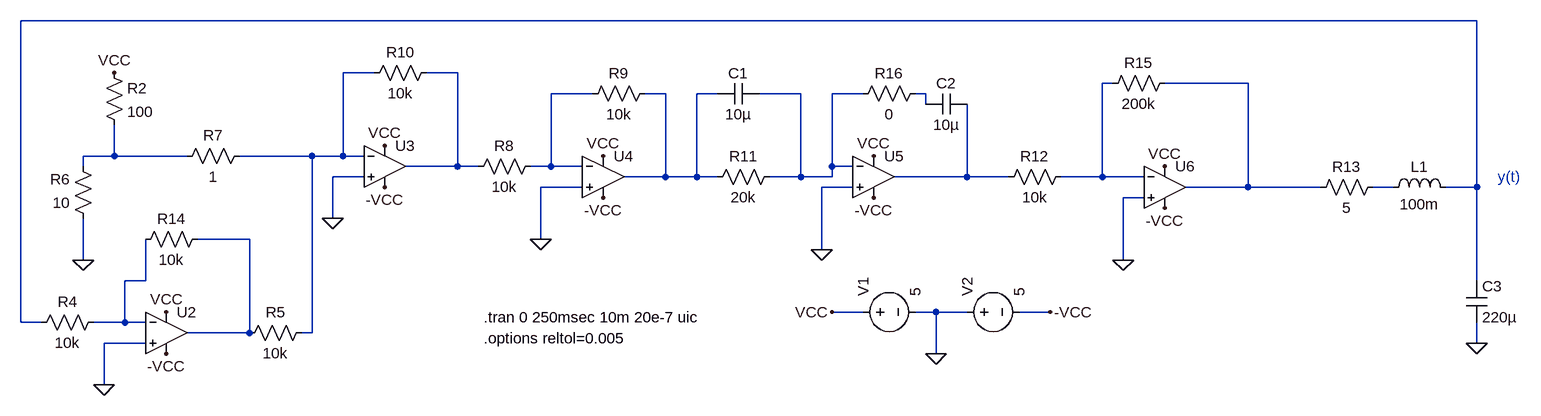
[diagram p0: schematic Circuito con componentes pasivos.asc]
Circuito con componentes pasivos.asc, the LTspice schematic file:
Version 4
SHEET 1 1872 984
WIRE 1536 -672 -704 -672
WIRE -160 -592 -208 -592
WIRE -32 -592 -80 -592
WIRE 976 -576 960 -576
WIRE 1184 -576 1056 -576
WIRE 176 -560 112 -560
WIRE 288 -560 256 -560
WIRE 368 -560 336 -560
WIRE 496 -560 432 -560
WIRE 592 -560 544 -560
WIRE 688 -560 672 -560
WIRE 688 -544 688 -560
WIRE -560 -464 -560 -512
WIRE -560 -464 -608 -464
WIRE -448 -464 -560 -464
WIRE -256 -464 -368 -464
WIRE -208 -464 -208 -592
WIRE -208 -464 -256 -464
WIRE -176 -464 -208 -464
WIRE -608 -448 -608 -464
WIRE -32 -448 -32 -592
WIRE -32 -448 -112 -448
WIRE 0 -448 -32 -448
WIRE 112 -448 112 -560
WIRE 112 -448 80 -448
WIRE 160 -448 112 -448
WIRE 544 -448 544 -560
WIRE 576 -448 544 -448
WIRE -176 -432 -224 -432
WIRE 288 -432 288 -560
WIRE 288 -432 224 -432
WIRE 336 -432 336 -560
WIRE 336 -432 288 -432
WIRE 368 -432 336 -432
WIRE 496 -432 496 -560
WIRE 496 -432 448 -432
WIRE 544 -432 544 -448
WIRE 544 -432 496 -432
WIRE 752 -432 752 -544
WIRE 752 -432 640 -432
WIRE 816 -432 752 -432
WIRE 960 -432 960 -576
WIRE 960 -432 896 -432
WIRE 1024 -432 960 -432
WIRE 160 -416 96 -416
WIRE 576 -416 528 -416
WIRE 1184 -416 1184 -576
WIRE 1184 -416 1088 -416
WIRE 1296 -416 1184 -416
WIRE 1408 -416 1376 -416
WIRE 1536 -416 1536 -672
WIRE 1536 -416 1488 -416
WIRE 1024 -400 992 -400
WIRE -224 -368 -224 -432
WIRE -352 -336 -432 -336
WIRE 96 -336 96 -416
WIRE 528 -320 528 -416
WIRE -608 -304 -608 -368
WIRE 992 -304 992 -400
WIRE -512 -272 -512 -336
WIRE -512 -272 -544 -272
WIRE 1536 -272 1536 -416
WIRE 592 -224 544 -224
WIRE 704 -224 672 -224
WIRE 752 -224 704 -224
WIRE 880 -224 832 -224
WIRE -704 -208 -704 -672
WIRE -672 -208 -704 -208
WIRE -544 -208 -544 -272
WIRE -544 -208 -592 -208
WIRE -512 -208 -544 -208
WIRE -352 -192 -352 -336
WIRE -352 -192 -448 -192
WIRE -256 -192 -256 -464
WIRE -256 -192 -272 -192
WIRE -512 -176 -576 -176
WIRE 1536 -176 1536 -208
WIRE 704 -160 704 -224
WIRE -576 -112 -576 -176
FLAG 1536 -176 0
FLAG 992 -304 0
FLAG 528 -320 0
FLAG 96 -336 0
FLAG -576 -112 0
FLAG -224 -368 0
FLAG -144 -480 VCC
FLAG -480 -224 VCC
FLAG 192 -464 VCC
FLAG 608 -464 VCC
FLAG 1056 -448 VCC
FLAG -144 -416 -VCC
FLAG -480 -160 -VCC
FLAG 192 -400 -VCC
FLAG 608 -400 -VCC
FLAG 1056 -384 -VCC
FLAG 544 -224 VCC
FLAG 880 -224 -VCC
FLAG -560 -592 VCC
FLAG -608 -304 0
FLAG 704 -160 0
SYMBOL res -576 -224 R90
WINDOW 0 0 56 VBottom 2
WINDOW 3 32 56 VTop 2
SYMATTR InstName R4
SYMATTR Value 10k
SYMBOL res -256 -208 R90
WINDOW 0 0 56 VBottom 2
WINDOW 3 32 56 VTop 2
SYMATTR InstName R5
SYMATTR Value 10k
SYMBOL res -592 -352 R180
WINDOW 0 36 76 Left 2
WINDOW 3 36 40 Left 2
SYMATTR InstName R6
SYMATTR Value 10
SYMBOL res -464 -448 R270
WINDOW 0 32 56 VTop 2
WINDOW 3 0 56 VBottom 2
SYMATTR InstName R7
SYMATTR Value 1
SYMBOL res -16 -432 R270
WINDOW 0 32 56 VTop 2
WINDOW 3 0 56 VBottom 2
SYMATTR InstName R8
SYMATTR Value 10k
SYMBOL res 160 -544 R270
WINDOW 0 32 56 VTop 2
WINDOW 3 0 56 VBottom 2
SYMATTR InstName R9
SYMATTR Value 10k
SYMBOL res -176 -576 R270
WINDOW 0 32 56 VTop 2
WINDOW 3 0 56 VBottom 2
SYMATTR InstName R10
SYMATTR Value 10k
SYMBOL res 352 -416 R270
WINDOW 0 32 56 VTop 2
WINDOW 3 0 56 VBottom 2
SYMATTR InstName R11
SYMATTR Value 20k
SYMBOL cap 432 -576 R90
WINDOW 0 0 32 VBottom 2
WINDOW 3 32 32 VTop 2
SYMATTR InstName C1
SYMATTR Value 10µ
SYMBOL cap 752 -560 R90
WINDOW 0 0 32 VBottom 2
WINDOW 3 32 32 VTop 2
SYMATTR InstName C2
SYMATTR Value 10µ
SYMBOL res 912 -448 R90
WINDOW 0 0 56 VBottom 2
WINDOW 3 32 56 VTop 2
SYMATTR InstName R12
SYMATTR Value 10k
SYMBOL res 1392 -432 R90
WINDOW 0 0 56 VBottom 2
WINDOW 3 32 56 VTop 2
SYMATTR InstName R13
SYMATTR Value 5
SYMBOL ind 1392 -400 R270
WINDOW 0 32 56 VTop 2
WINDOW 3 5 56 VBottom 2
SYMATTR InstName L1
SYMATTR Value 100m
SYMBOL cap 1520 -272 R0
SYMATTR InstName C3
SYMATTR Value 220µ
SYMBOL res -416 -352 R90
WINDOW 0 0 56 VBottom 2
WINDOW 3 32 56 VTop 2
SYMATTR InstName R14
SYMATTR Value 10k
SYMBOL res 1072 -592 R90
WINDOW 0 0 56 VBottom 2
WINDOW 3 32 56 VTop 2
SYMATTR InstName R15
SYMATTR Value 200k
SYMBOL res 688 -576 R90
WINDOW 0 0 56 VBottom 2
WINDOW 3 32 56 VTop 2
SYMATTR InstName R16
SYMATTR Value 0
SYMBOL voltage 576 -224 R270
WINDOW 123 0 0 Left 0
WINDOW 39 0 0 Left 0
SYMATTR InstName V1
SYMATTR Value 5
SYMBOL voltage 736 -224 R270
WINDOW 123 0 0 Left 0
WINDOW 39 0 0 Left 0
SYMATTR InstName V2
SYMATTR Value 5
SYMBOL res -576 -608 R0
SYMATTR InstName R2
SYMATTR Value 100
SYMBOL OpAmps\\UniversalOpAmp2 -480 -192 R0
SYMATTR InstName U2
SYMBOL OpAmps\\UniversalOpAmp2 -144 -448 R0
SYMATTR InstName U3
SYMBOL OpAmps\\UniversalOpAmp2 192 -432 R0
SYMATTR InstName U4
SYMBOL OpAmps\\UniversalOpAmp2 608 -432 R0
SYMATTR InstName U5
SYMBOL OpAmps\\UniversalOpAmp2 1056 -416 R0
SYMATTR InstName U6
TEXT 8 -216 Left 2 !.tran 0 250msec 10m 20e-7 uic
TEXT 1568 -432 Left 2 ;y(t)
TEXT 8 -184 Left 2 !.options reltol=0.005

The netlist it stands for:
* Circuito con componentes pasivos.asc
R4 N014 N001 10k
R5 N002 N013 10k
R6 0 N010 10
R7 N010 N002 1
R8 N003 N006 10k
R9 N006 N007 10k
R10 N002 N003 10k
R11 N007 N008 20k
C1 N008 N007 10µ
C2 N011 N009 10µ
R12 N004 N011 10k
R13 N012 N005 5
L1 N012 N001 100m
C3 N001 0 220µ
R14 N013 N014 10k
R15 N005 N004 200k
R16 N009 N008 0
V1 VCC 0 5
V2 0 -VCC 5
R2 VCC N010 100
XU2 0 N014 VCC -VCC N013 level2 Avol=1Meg GBW=10Meg Slew=10Meg Ilimit=25m Rail=0 Vos=0 En=0 Enk=0 In=0 Ink=0 Rin=500Meg  ; pins In+ In- V+ V- OUT
XU3 0 N002 VCC -VCC N003 level2 Avol=1Meg GBW=10Meg Slew=10Meg Ilimit=25m Rail=0 Vos=0 En=0 Enk=0 In=0 Ink=0 Rin=500Meg  ; pins In+ In- V+ V- OUT
XU4 0 N006 VCC -VCC N007 level2 Avol=1Meg GBW=10Meg Slew=10Meg Ilimit=25m Rail=0 Vos=0 En=0 Enk=0 In=0 Ink=0 Rin=500Meg  ; pins In+ In- V+ V- OUT
XU5 0 N008 VCC -VCC N011 level2 Avol=1Meg GBW=10Meg Slew=10Meg Ilimit=25m Rail=0 Vos=0 En=0 Enk=0 In=0 Ink=0 Rin=500Meg  ; pins In+ In- V+ V- OUT
XU6 0 N004 VCC -VCC N005 level2 Avol=1Meg GBW=10Meg Slew=10Meg Ilimit=25m Rail=0 Vos=0 En=0 Enk=0 In=0 Ink=0 Rin=500Meg  ; pins In+ In- V+ V- OUT
.tran 0 250msec 10m 20e-7 uic
* y(t)
.options reltol=0.005
.lib UniversalOpAmp2.lib
.backanno
.end